# Altium schematic sheet Wrist watch main.SchDoc: Wrist watch main
size A4; Subtitle: Subtitle; Project: Stearsafe; VersionRevision: VersionRevision; TotalSheet: TotalSheet; Author: Sajitha Madugalle; Revision: 1; SheetNumber: 1; SheetTotal: 9
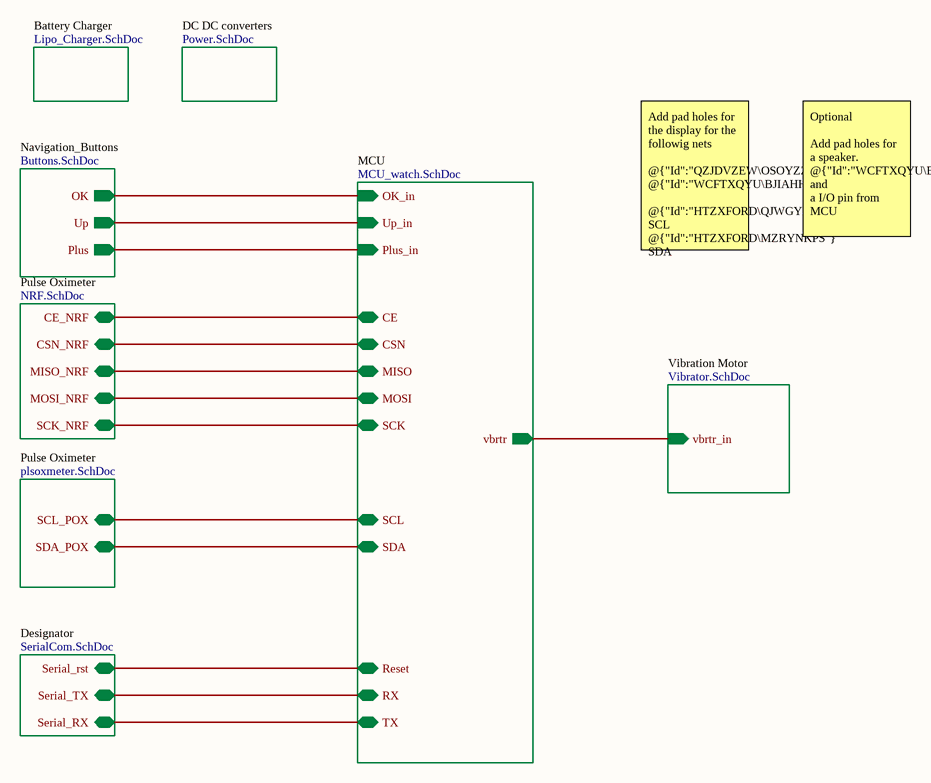
[diagram p0: Wrist watch main.SchDoc]

## Sub-sheets
Battery Charger = Lipo_Charger.SchDoc: no entries
DC DC converters = Power.SchDoc: no entries
Designator = SerialCom.SchDoc: Serial_rst (bidir), Serial_TX (bidir), Serial_RX (bidir)
MCU = MCU_watch.SchDoc: SDA (bidir), SCL (bidir), OK_in (in), Up_in (in), Plus_in (in), vbrtr (out), CE (bidir), CSN (bidir), MISO (bidir), MOSI (bidir), SCK (bidir), Reset (bidir), RX (bidir), TX (bidir)
Navigation_Buttons = Buttons.SchDoc: OK (out), Up (out), Plus (out)
Pulse Oximeter = plsoxmeter.SchDoc: SCL_POX (bidir), SDA_POX (bidir)
Pulse Oximeter = NRF.SchDoc: CE_NRF (bidir), CSN_NRF (bidir), MISO_NRF (bidir), MOSI_NRF (bidir), SCK_NRF (bidir)
Vibration Motor = Vibrator.SchDoc: vbrtr_in (in)

## Nets
(unnamed): sheet MCU/SDA, sheet Pulse Oximeter/SDA_POX
(unnamed): sheet MCU/SCL, sheet Pulse Oximeter/SCL_POX
(unnamed): sheet MCU/OK_in, sheet Navigation_Buttons/OK
(unnamed): sheet MCU/Up_in, sheet Navigation_Buttons/Up
(unnamed): sheet MCU/Plus_in, sheet Navigation_Buttons/Plus
(unnamed): sheet MCU/vbrtr, sheet Vibration Motor/vbrtr_in
(unnamed): sheet MCU/CE, sheet Pulse Oximeter/CE_NRF
(unnamed): sheet MCU/CSN, sheet Pulse Oximeter/CSN_NRF
(unnamed): sheet MCU/MISO, sheet Pulse Oximeter/MISO_NRF
(unnamed): sheet MCU/MOSI, sheet Pulse Oximeter/MOSI_NRF
(unnamed): sheet MCU/SCK, sheet Pulse Oximeter/SCK_NRF
(unnamed): sheet MCU/Reset, sheet Designator/Serial_rst
(unnamed): sheet MCU/RX, sheet Designator/Serial_TX
(unnamed): sheet MCU/TX, sheet Designator/Serial_RX

## Notes on the sheet
- Add pad holes for the display for the followig nets
  @{"Id":"QZJDVZEW\OSOYZZOG"} @{"Id":"WCFTXQYU\BJIAHHOM"}
  @{"Id":"HTZXFORD\QJWGYBCR"} SCL
  @{"Id":"HTZXFORD\MZRYNKPS"} SDA
- Optional
  Add pad holes for a speaker. @{"Id":"WCFTXQYU\BJIAHHOM"} and
  a I/O pin from MCU
- Title:
- Size:
- Document Number :
- Revision
- Drawn by:
- Checked by:
- Date:
- A4
- Time:
- Aprooved by:
- Sheet:
- of
- File: